# Altium project Bop_It.PrjPcb
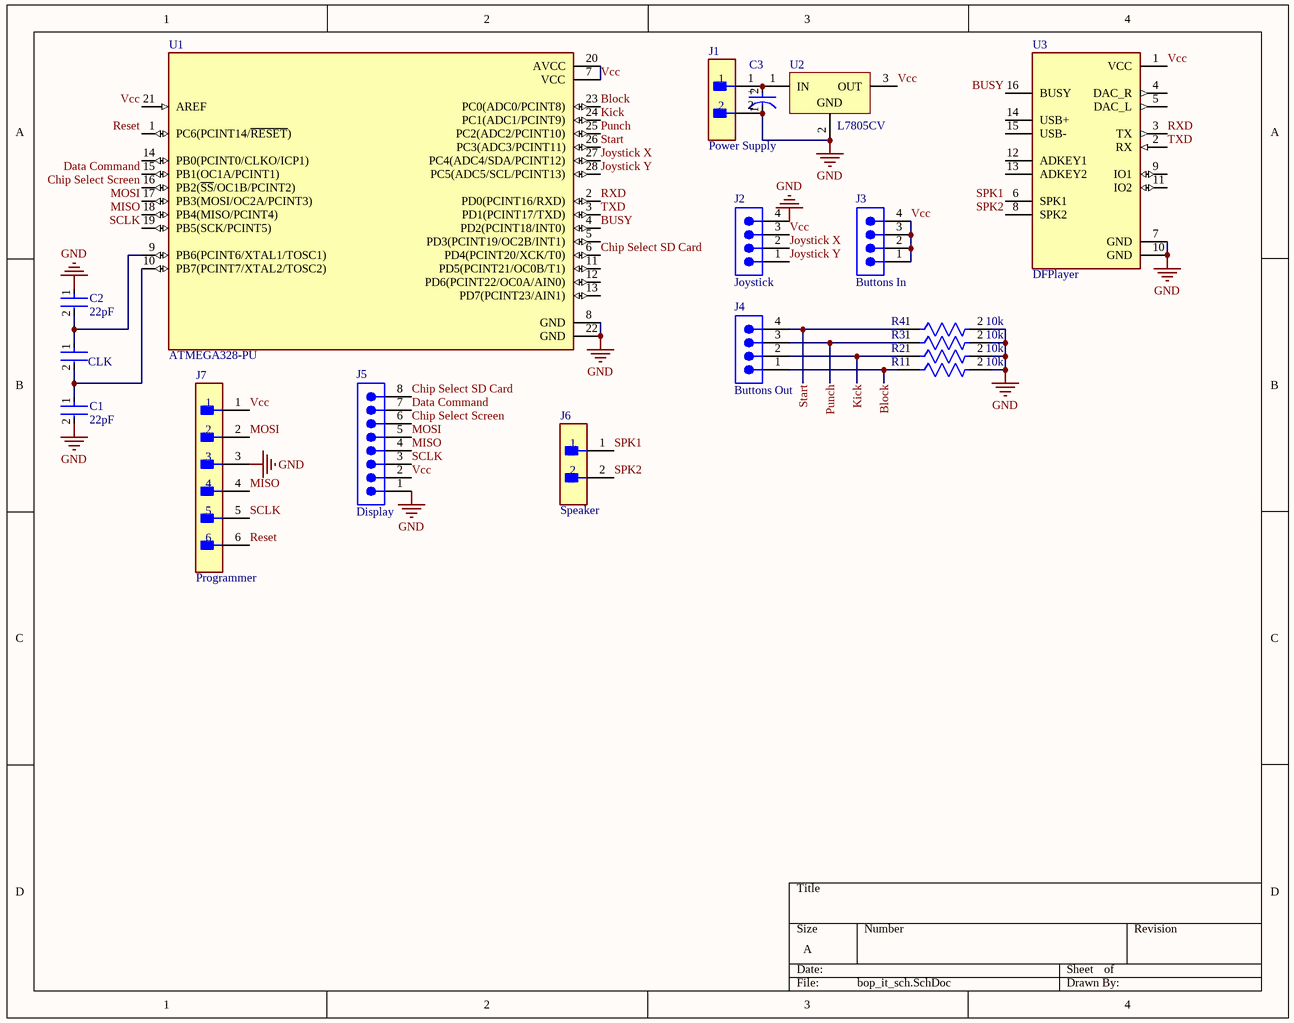
[diagram p0: bop_it_sch.SchDoc]
1 sheet, 18 parts. Net scope: global (net labels, ports and power ports of the same name join across sheets).
Board file: bop_it_pcb.PcbDoc

## Sheet bop_it_sch.SchDoc
size A; SheetNumber: 1; SheetTotal: 1

### Parts
C1  22pF  [FP-RDE0M1-MFG]
C2  22pF  [FP-RDE0M1-MFG]
C3  (no value)  [FP-RAD-TH-D_5_0_5-L_11_1-MFG]
CLK  (no value)  [FP-RDE0M1-MFG]
J1  Power Supply  [FP-M20-9990246-MFG]
J2  Joystick  [61300411121]
J3  Buttons In  [61300411121]
J4  Buttons Out  [61300411121]
J5  Display  [61300811121]
J6  Speaker  [FP-M20-9990246-MFG]
J7  Programmer  [FP-22-28-4060-MFG]
R1  10k  [FP-MBB0207-MFG]
R2  10k  [FP-MBB0207-MFG]
R3  10k  [FP-MBB0207-MFG]
R4  10k  [FP-MBB0207-MFG]
U1  ATMEGA328-PU  [DIP787W46P254L3467H508Q28]
U2  L7805CV  [TO220FP]
U3  DFPlayer  [MODULE_DFR0299]

### Nets
GND: C1.2 C2.1 C3.1(C) J1.2 J2.4 J5.1 J7.3 R1.2 R2.2 R3.2 R4.2 U1.8(GND) U1.22(GND) U2.2(GND) U3.7(GND) U3.10(GND)
Block: J4.1 R1.1 U1.23(PC0(ADC0/PCINT8))
BUSY: U1.4(PD2(PCINT18/INT0)) U3.16(BUSY)
Chip Select Screen: J5.6 U1.16(PB2(~{SS}/OC1B/PCINT2))
Chip Select SD Card: J5.8 U1.6(PD4(PCINT20/XCK/T0))
Data Command: J5.7 U1.15(PB1(OC1A/PCINT1))
Joystick X: J2.2 U1.27(PC4(ADC4/SDA/PCINT12))
Joystick Y: J2.1 U1.28(PC5(ADC5/SCL/PCINT13))
Kick: J4.2 R2.1 U1.24(PC1(ADC1/PCINT9))
MISO: J5.4 J7.4 U1.18(PB4(MISO/PCINT4))
MOSI: J5.5 J7.2 U1.17(PB3(MOSI/OC2A/PCINT3))
Punch: J4.3 R3.1 U1.25(PC2(ADC2/PCINT10))
Reset: J7.6 U1.1(PC6(PCINT14/~{RESET}))
RXD: U1.2(PD0(PCINT16/RXD)) U3.3(TX)
SCLK: J5.3 J7.5 U1.19(PB5(SCK/PCINT5))
SPK1: J6.1 U3.6(SPK1)
SPK2: J6.2 U3.8(SPK2)
Start: J4.4 R4.1 U1.26(PC3(ADC3/PCINT11))
TXD: U1.3(PD1(PCINT17/TXD)) U3.2(RX)
Vcc: J2.3 J3.1 J3.2 J3.3 J3.4 J5.2 J7.1 U1.7(VCC) U1.20(AVCC) U1.21(AREF) U2.3(OUT) U3.1(VCC)
NetC1_1: C1.1 CLK.2 U1.10(PB7(PCINT7/XTAL2/TOSC2))
NetC2_2: C2.2 CLK.1 U1.9(PB6(PCINT6/XTAL1/TOSC1))
NetC3_2: C3.2(A) J1.1 U2.1(IN)

Not connected (* = marked no-connect by the designer): U1 5(PD3(PCINT19/OC2B/INT1)) 11(PD5(PCINT21/OC0B/T1)) 12(PD6(PCINT22/OC0A/AIN0)) 13(PD7(PCINT23/AIN1)) 14(PB0(PCINT0/CLKO/ICP1)); U3 4(DAC_R) 5(DAC_L) 9(IO1) 11(IO2) 12(ADKEY1) 13(ADKEY2) 14(USB+) 15(USB-)

### Notes on the sheet
- (in symbol CMP-05427-001266-1) +

### Library data of the parts
C1 C2 CLK = CMP-06035-043024-1: Ceramic Capacitor 10nF ±10% 50V X7R Radial; Lead/Base Style: Kinked; Lead Diameter: 0.5mm; Width: 0.098inch; Tolerance: 10%; Package Quantity: 500; Termination: Radial; Resistor Type: Ceramic; Min Operating Temperature: -55°C; Packaging: Bulk; Height - Seated (Max): 0.236inch; Height: 3.5mm; Lead Pitch: 0.197inch; Capacitance: 10nF; Length: 0.157inch; Lead Free: Lead Free; Max Operating Temperature: 125°C; Mount: Through Hole; Voltage Rating (DC): 50V; Voltage Rating: 50V; Case/Package: Radial; Dielectric: X7R
C3 = CMP-05427-001266-1: Aluminum Electrolytic Capacitors (Radial Lead Type) 1uF ±20% 50V; Ripple Current: 8mA; Life (Hours): 5000Hour; Lead Diameter: 0.5mm; Min Operating Temperature: -40°C; Series: EB; Mount: Through Hole; Max Operating Temperature: 105°C; Lead Pitch: 5mm; Height: 11mm; Voltage Rating: 50V; Voltage Rating (DC): 50V; Case/Package: Radial; Package Quantity: 2000; Termination: Radial; Capacitance: 1uF; Diameter: 5mm; Height - Seated (Max): 0.472inch; Length: 11mm; Tolerance: 20%; Packaging: Tape and Reel; RoHS Compliant: Yes; Radiation Hardening: No
J1 J6 = CMP-15831-000009-1: CONN HEADER VERT 2POS 2.54MM; Manufacturer: Harwin; Manufacturer Part Number: M20-9990246; Conn Gender: Male; Description: Connector Header Through Hole 2 position 0.100" (2.54mm); Conn Orientation: Vertical; Number Of Contacts: 2; Current Rating: 3A; ComponentLink2URL: https://cdn.harwin.com/pdfs/M20-999.pdf; ComponentLink2Description: Datasheet; Package: M20-9990246; Temperature: -40°C to +105°C; Octopart: https://octopart.com/m20-9990246-harwin-2590635; Mouser Description: 2.54mm (0.1") Pitch SIL Vertical PC Tail Pin Header, 6.1mm mating pin height, tin, 2 contacts; Temperature Range High: +105°C; Device Class L1: Connectors; RoHS: TRUE; Automotive: No; Height: 8.99mm; Number Of Rows: 1; Contact Material: Tin,Nickel; Category: Conn; Pitch: 2.54mm; Lead Free: Yes; Digikey Description: CONN HEADER VERT 2POS 2.54MM; Temperature Range Low: -40°C; Device Class L3: unset; Device Class L2: Headers and Wire Housings
J2-J4 = CMP-1502-01064-3: NexarPartId: 32855522; Operating Supply Voltage: 250V; Pitch: 2.54mm; Contact Resistance: 20mΩ; Number of Positions: 4; Current Rating: 3A; Connector Type: Male Pin; Gender: Male; Contact Plating: Gold; Height: 8.89mm; Lead Pitch: 2.54mm; Lead Free: Lead Free; Contact Mating Length: 5.9944mm; Number of Rows: 1; Termination: Solder; Packaging: Bulk; REACH SVHC: Unknown; Min Operating Temperature: -40°C; RoHS: Compliant; Number of Contacts: 4; Voltage Rating: 250V; Color: Black; Max Operating Temperature: 105°C; Contact Material: Copper; Mount: Through Hole; Orientation: Vertical; Number of Pins: 4
J5 = CMP-1502-01076-3: NexarPartId: 32855533; Connector Type: Male Pin; Number of Contacts: 8; Voltage Rating: 250V; Current Rating: 3A; Contact Resistance: 20mΩ; Pitch: 2.54mm; Gender: Male; Termination: Solder; Contact Material: Copper; Mount: Through Hole; Lead Pitch: 2.54mm; Number of Positions: 8; Operating Supply Voltage: 250V; Number of Pins: 8; Max Operating Temperature: 105°C; Height: 8.54mm; REACH SVHC: Unknown; Number of Rows: 1; Packaging: Bulk; Contact Plating: Gold; Contact Mating Length: 5.9944mm; Orientation: Vertical; RoHS: Compliant; Color: Black; Min Operating Temperature: -40°C
J7 = CMP-04776-000763-1: CONN HEADER VERT 6POS 2.54MM; Voltage Rating: 250V; Current Rating: 4A; Number of Contacts: 6; Max Voltage Rating (DC): 250.25kV; Gender: Male; Contact Resistance: 20mR; Connector Type: Male Pin; Color: Black; Max Voltage Rating (AC): 250V; Pitch: 2.54mm; Orientation: Straight; Max Operating Temperature: 75°C; Contact Plating: Tin; Depth: 2.49mm; Contact Type: Male Pin; Number of Positions: 6; Length: 15.24mm; Packaging: Bulk; Mount: Through Hole; Housing Material: Thermoplastic; Housing Color: Black; Termination: Solder; Contact Material: Brass; Min Operating Temperature: 0°C; Series: KK® 42375; Number of Rows: 1; Package Quantity: 1; RoHS Compliant: Yes; Contact Mating Length: 0.24inch
R1-R4 = CMP-02408-000035-1: RES 10K OHM 0.6W 1% AXIAL; Voltage Rating: 300V; Resistance: 10kR; Max Power Dissipation: 600mW; Temperature Coefficient: 50ppm/°C; Radiation Hardening: No; Case/Package: Conformal; Termination: Axial; Military Standard: Not; Length: 6.5mm; Voltage Rating (DC): 300V; RoHS Compliant: Yes; Number of Terminations: 2; Packaging: Tape and Reel; Features: Automotive AEC-Q200; Tolerance: 1%; Min Operating Temperature: -55°C; Power Rating: 600mW; Lead Free: Lead Free; Resistor Type: Metal Film; Construction: Cylindrical; Series: MBB 0207 - Professional; Max Operating Temperature: 155°C; Diameter: 2.5mm; Resistance Tolerance: 1%; Contact Plating: Tin; Technology: THIN FILM
U1 = ATMEGA328-PU: AVR AVRÂ® ATmega Microcontroller IC 8-Bit 20MHz 32KB (16K x 16) FLASH 28-PDIP; MF: Microchip; Availability: In Stock; MP: ATMEGA328-PU; SnapEDA_Link: https://www.snapeda.com/parts/ATMEGA328-PU/Microchip/view-part/?ref=snap; Value: *; Price: None; Purchase-URL: https://pricing.snapeda.com/search/part/ATMEGA328-PU/?ref=eda; Check_prices: https://www.snapeda.com/parts/ATMEGA328-PU/Microchip/view-part/?ref=eda; Package: DIP-28 Microchip Technology
U2 = CMP-0244-00479-1: Positive Voltage Regulator, 5V, 3-Pin TO-220FP; DatasheetVersion: 16/11/2011; PackageReference: TO220FP; ComponentLink1URL: http://www.st.com; PackageDescription: TO, Thru-Hole, Vertical, Heatsink Mounted; 3 In-Line Leads; Pitch 2.54 mm; ComponentLink2Description: Datasheet; PackageVersion: 2011; ComponentLink1Description: Manufacturer URL; ComponentLink2URL: http://www.st.com/internet/com/TECHNICAL_RESOURCES/TECHNICAL_LITERATURE/DATASHEET/CD00000444.pdf
U3 = DFR0299: - MP3 Player Audio Arduino Platform Evaluation Expansion Board; MF: DFRobot; SnapEDA_Link: https://www.snapeda.com/parts/DFR0299/DFRobot/view-part/?ref=snap; Package: None; Value: *; MP: DFR0299; Check_prices: https://www.snapeda.com/parts/DFR0299/DFRobot/view-part/?ref=eda